# EAGLE design apple_night_light (EAGLE 7.2.0)
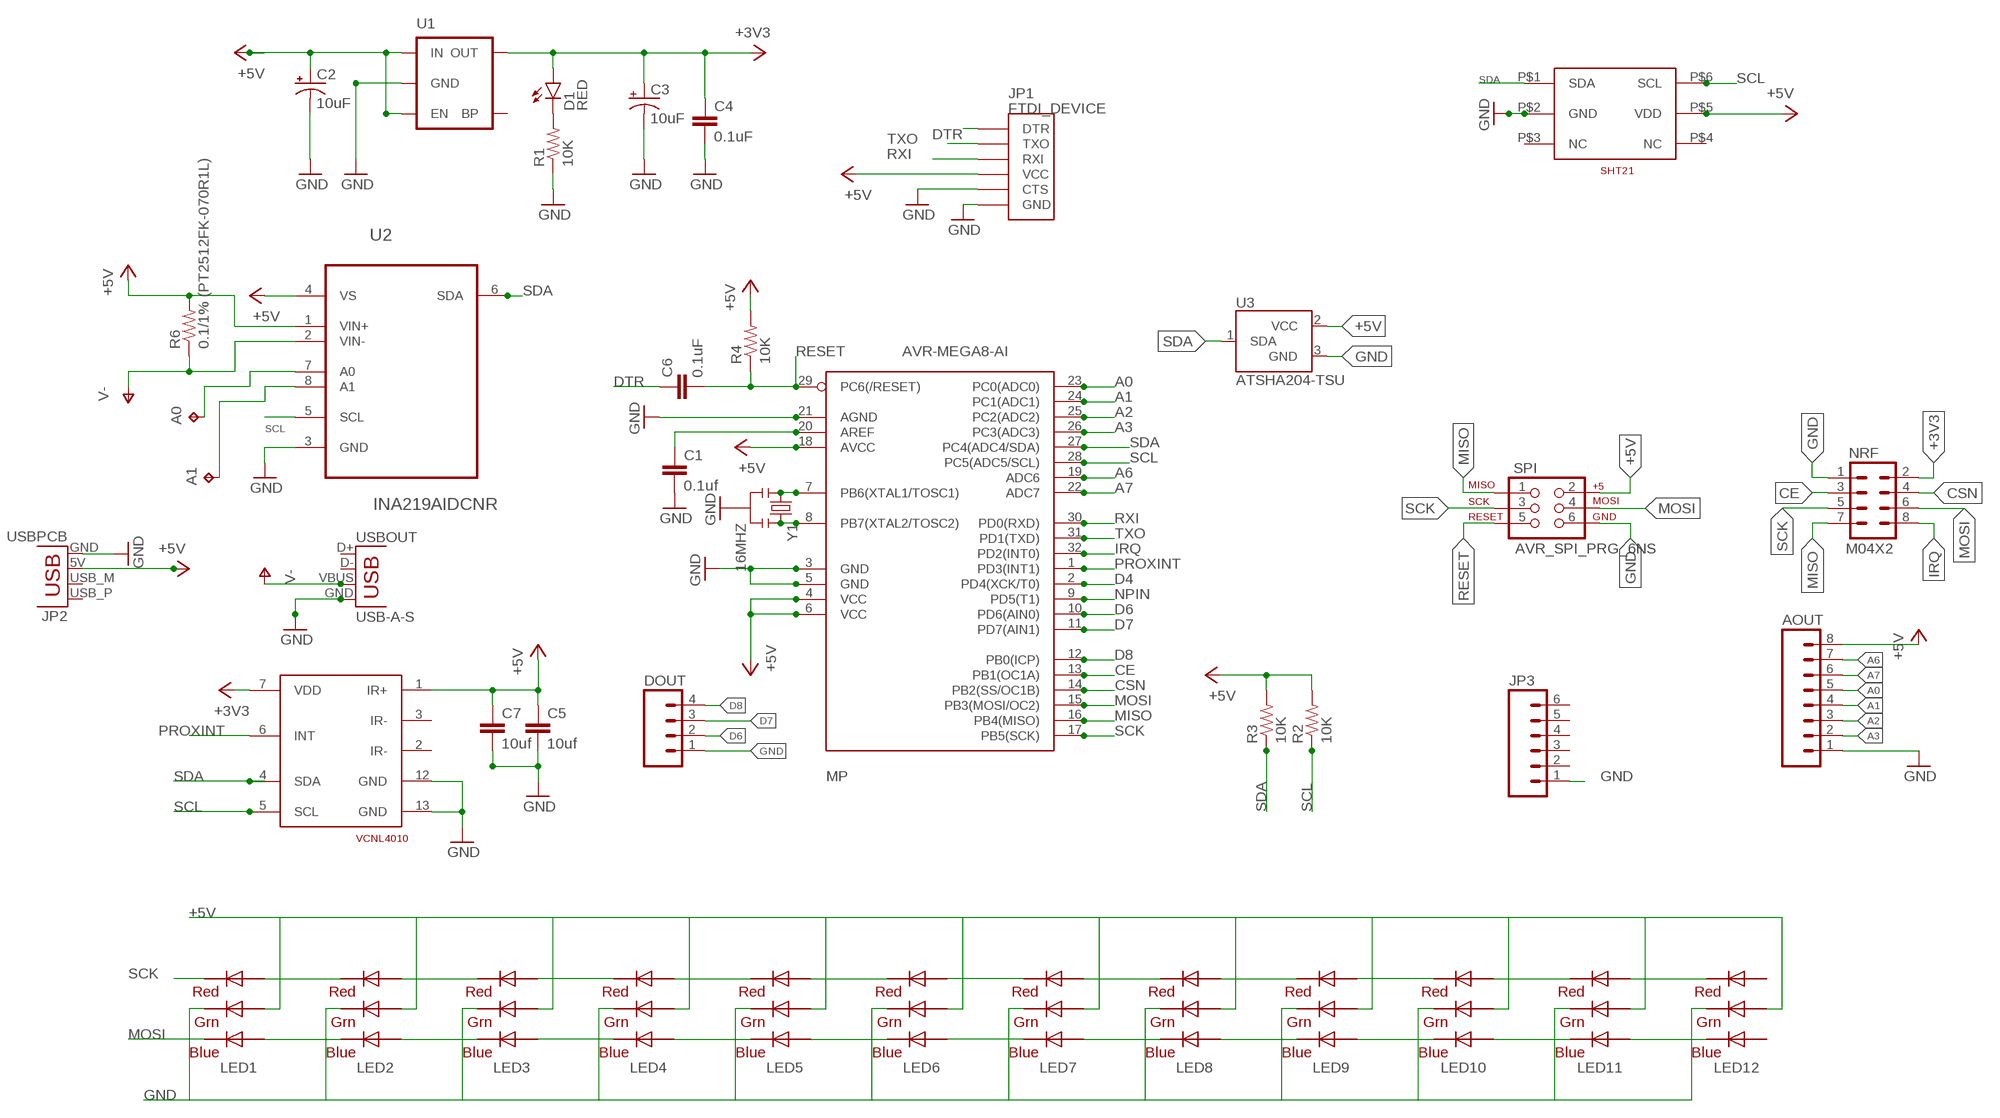
[diagram p0: schematic, sheet 1]

## Parts
A0  TPB1,27  [B1,27]
A1  TPB1,27  [B1,27]
AOUT  M08LOCK  [1X08_LOCK]
C1  0.1uf  2.2UF-25V-+80/-20(0805)  [0805]
C2  10uF  10UF-16V-10%(TANT)  [EIA3216]
C3  10uF  10UF-16V-10%(TANT)  [EIA3216]
C4  0.1uF  0.1UF-25V(+80/-20%)(0603)  [0603-CAP]
C5  10uf  CAP0805  [0805]
C6  0.1uF  0.1UF-25V(+80/-20%)(0603)  [0603-CAP]
C7  10uf  CAP0805  [0805]
D1  RED  LED-RED0603  [LED-0603]
DOUT  M04LOCK  [1X04_LOCK]
JP1  FTDI_DEVICE  [FTDI_DEVICE_SIDE]
JP2  USBPCB  [USB-A-PCB]
JP3  M06NO_SILK_FEMALE_PTH  [1X06_NO_SILK]
LED1  RGBLED5050  [RGBLED5050]
LED2  RGBLED5050  [RGBLED5050]
LED3  RGBLED5050  [RGBLED5050]
LED4  RGBLED5050  [RGBLED5050]
LED5  RGBLED5050  [RGBLED5050]
LED6  RGBLED5050  [RGBLED5050]
LED7  RGBLED5050  [RGBLED5050]
LED8  RGBLED5050  [RGBLED5050]
LED9  RGBLED5050  [RGBLED5050]
LED10  RGBLED5050  [RGBLED5050]
LED11  RGBLED5050  [RGBLED5050]
LED12  RGBLED5050  [RGBLED5050]
MP  AVR-MEGA8-AI  [TQFP32-08]
NRF  M04X2  [2X4]
R1  10K  10KOHM-1/10W-1%(0603)0603  [0603-RES]
R2  10K  10KOHM-1/10W-1%(0603)0603  [0603-RES]
R3  10K  10KOHM-1/10W-1%(0603)0603  [0603-RES]
R4  10K  10KOHM-1/10W-1%(0603)0603  [0603-RES]
R6  0.1/1% (PT2512FK-070R1L)  RESISTOR2512  [R2512]
SPI  AVR_SPI_PRG_6NS  [2X3-NS]
U1  MIC52053.3V  [SOT23-5]
U2  INA219AIDCNR  [SOT65P280X145-8N]
U3  ATSHA204-TSU  [SOT23-3]
U$1  SHT21  [DFN6]
U$3  VCNL4010  [VCNL4010]
USBOUT  USB-A-S  [USB-A-S]
Y1  16MHZ  RESONATOR16MHZ  [RESONATOR-SMD]

## Nets
+3V3: C3.A(+) C4.1 D1.A NRF.2 U1.5(OUT) U$3.7(VDD)
+5V: AOUT.8 C2.A(+) C5.1 C7.1 JP1.P$4(VCC) JP2.5V(VBUS) LED1.1(GREEN_A) LED2.1(GREEN_A) LED3.1(GREEN_A) LED4.1(GREEN_A) LED5.1(GREEN_A) LED6.1(GREEN_A) LED7.1(GREEN_A) LED8.1(GREEN_A) LED9.1(GREEN_A) LED10.1(GREEN_A) LED11.1(GREEN_A) LED12.1(GREEN_A) MP.4(VCC) MP.6(VCC) MP.18(AVCC) R2.2 R3.2 R4.2 R6.2 SPI.2 U1.1(IN) U1.3(EN) U2.1(VIN+) U2.4(VS) U3.2(VCC) U$1.P$5(VDD) U$3.1(IR+)
A0: AOUT.5 MP.23(PC0(ADC0))
A1: AOUT.4 MP.24(PC1(ADC1))
A2: AOUT.3 MP.25(PC2(ADC2))
A3: AOUT.2 MP.26(PC3(ADC3))
A6: AOUT.7 MP.19(ADC6)
A7: AOUT.6 MP.22(ADC7)
APACI1: LED3.2(RED_A) LED4.5(RED_C)
APACI2: LED6.2(RED_A) LED7.5(RED_C)
APACI3: LED9.2(RED_A) LED10.5(RED_C)
CE: MP.13(PB1(OC1A)) NRF.3
CSN: MP.14(PB2(SS/OC1B)) NRF.4
D4: MP.2(PD4(XCK/T0))
D6: DOUT.2 MP.10(PD6(AIN0))
D7: DOUT.3 MP.11(PD7(AIN1))
D8: DOUT.4 MP.12(PB0(ICP))
DTR: C6.1 JP1.P$1(DTR)
GND: AOUT.1 C1.2 C2.C(-) C3.C(-) C4.2 C5.2 C7.2 DOUT.1 JP1.P$5(CTS) JP1.P$6(GND) JP2.GND JP3.1 LED1.6(GREEN_C) LED2.6(GREEN_C) LED3.6(GREEN_C) LED4.6(GREEN_C) LED5.6(GREEN_C) LED6.6(GREEN_C) LED7.6(GREEN_C) LED8.6(GREEN_C) LED9.6(GREEN_C) LED10.6(GREEN_C) LED11.6(GREEN_C) LED12.6(GREEN_C) MP.3(GND) MP.5(GND) MP.21(AGND) NRF.1 R1.1 SPI.6 U1.2(GND) U2.3(GND) U3.3(GND) U$1.P$2(GND) U$3.12(GND) U$3.13(GND) USBOUT.GND Y1.2
IRQ: MP.32(PD2(INT0)) NRF.8
MISO: MP.16(PB4(MISO)) NRF.7 SPI.1
MOSI: LED1.4(BLUE_C) MP.15(PB3(MOSI/OC2)) NRF.6 SPI.4
N$1: LED1.2(RED_A) LED2.5(RED_C)
N$2: LED2.2(RED_A) LED3.5(RED_C)
N$3: LED1.3(BLUE_A) LED2.4(BLUE_C)
N$5: LED2.3(BLUE_A) LED3.4(BLUE_C)
N$6: LED3.3(BLUE_A) LED4.4(BLUE_C)
N$7: C1.1 MP.20(AREF)
N$8: LED6.3(BLUE_A) LED7.4(BLUE_C)
N$9: MP.8(PB7(XTAL2/TOSC2)) Y1.3
N$10: MP.7(PB6(XTAL1/TOSC1)) Y1.1
N$12: LED9.3(BLUE_A) LED10.4(BLUE_C)
N$15: LED4.2(RED_A) LED5.5(RED_C)
N$17: LED5.2(RED_A) LED6.5(RED_C)
N$18: LED4.3(BLUE_A) LED5.4(BLUE_C)
N$19: LED5.3(BLUE_A) LED6.4(BLUE_C)
N$23: LED7.2(RED_A) LED8.5(RED_C)
N$24: LED8.2(RED_A) LED9.5(RED_C)
N$25: LED7.3(BLUE_A) LED8.4(BLUE_C)
N$26: LED8.3(BLUE_A) LED9.4(BLUE_C)
N$29: D1.C R1.2
N$30: LED10.2(RED_A) LED11.5(RED_C)
N$31: LED11.2(RED_A) LED12.5(RED_C)
N$32: LED10.3(BLUE_A) LED11.4(BLUE_C)
N$35: LED11.3(BLUE_A) LED12.4(BLUE_C)
N$43: A0.TP U2.7(A0)
N$44: A1.TP U2.8(A1)
NPIN: MP.9(PD5(T1))
PROXINT: MP.1(PD3(INT1)) U$3.6(INT)
RESET: C6.2 MP.29(PC6(/RESET)) R4.1 SPI.5
RXI: JP1.P$3(RXI) MP.30(PD0(RXD))
SCK: LED1.5(RED_C) MP.17(PB5(SCK)) NRF.5 SPI.3
SCL: MP.28(PC5(ADC5/SCL)) R2.1 U2.5(SCL) U$1.P$6(SCL) U$3.5(SCL)
SDA: MP.27(PC4(ADC4/SDA)) R3.1 U2.6(SDA) U3.1(SDA) U$1.P$1(SDA) U$3.4(SDA)
TXO: JP1.P$2(TXO) MP.31(PD1(TXD))
V-: R6.1 U2.2(VIN-) USBOUT.VBUS
Unconnected: JP2.USB_M(D-) JP2.USB_P(D+) JP3.2 JP3.3 JP3.4 JP3.5 JP3.6 LED12.2(RED_A) LED12.3(BLUE_A) U1.4(BP) U$1.P$3(NC) U$1.P$4(NC) USBOUT.D+ USBOUT.D-

## Power pins joined to a net without a drawn wire
IR-: U$3.2(IR-) U$3.3(IR-)

## Library data of the parts
A0 A1 = testpad:TP: Test pad
AOUT = SparkFun-Connectors:M08: Header 8 Standard 8-pin 0.1" header. Use with straight break away headers (SKU : PRT-00116), right angle break away headers (PRT-00553), swiss pins (PRT-00743), machine pins (PRT-00117), and female headers (PRT-00115).
C1 = SparkFun-Capacitors:2.2UF-25V-+80/-20(0805): CAP-11624; PROD_ID: CAP-11624; VALUE: 2.2uF
C2 C3 = SparkFun-Capacitors:10UF-16V-10%(TANT): CAP-00811 1206/EIA-3216 Tantalum capacitor; PROD_ID: CAP-00811
C4 C6 = SparkFun-Capacitors:0.1UF-25V(+80/-20%)(0603): CAP-00810 Ceramic Standard decoupling cap; PROD_ID: CAP-00810
C5 C7 = SparkFun-Passives:CAP: Capacitor Standard 0603 ceramic capacitor, and 0.1" leaded capacitor.
D1 = SparkFun-LED:LED-RED: Assorted Red LEDs LilyPad 1206- DIO-09912 1206- DIO-00809 0603- DIO-00819; PROD_ID: DIO-00819
DOUT = SparkFun-Connectors:M04: Header 4 Standard 4-pin 0.1" header. Use with straight break away headers (SKU : PRT-00116), right angle break away headers (PRT-00553), swiss pins (PRT-00743), machine pins (PRT-00117), and female headers (PRT-00115). Molex polarized connector foot print use with SKU : PRT-08231 with associated crimp pins and housings. 1MM SMD Version SKU: PRT-10208
JP1 = SparkFun-Connectors:FTDI_DEVICE: Connector which mates to FTDI basic or FTDI cable.
JP2 USBOUT = SparkFun-Connectors:USB: USB Connectors USB-B-PTH is fully proven SKU : PRT-00139/CONN-08278 USB-miniB is fully proven SKU : PRT-00587 USB-A-PCB is untested. USB-A-H is throughly reviewed, but untested. Spark Fun Electronics SKU : PRT-00437 USB-B-SMT is throughly reviewed, but untested. Needs silkscreen touching up. USB-A-S has not been used/tested USB-MB-H has not been used/tested USB-MICROB has been used. CONN-09505
JP3 = SparkFun-Connectors:M06: Header 6 Standard 6-pin 0.1" header. Use with straight break away headers (SKU : PRT-00116), right angle break away headers (PRT-00553), swiss pins (PRT-00743), machine pins (PRT-00117), and female headers (PRT-00115). Molex polarized connector foot print use with SKU : PRT-08094 with associated crimp pins and housings. NOTES ON THE VARIANTS LOCK and LOCK_LONGPADS... This footprint was designed to help hold the alignment of a through-hole component (i.e. 6-pin header) while soldering it into place. You may notice that each hole has been shifted either up or down by 0.005 of an inch from it's more standard position (which is a perfectly straight line). This slight alteration caused the pins (the squares in the middle) to touch the edges of the holes. Because they are alternating, it causes a "brace" to hold the component in place. 0.005 has proven to be the perfect amount of "off-center" position when using our standard breakaway headers. Although looks a little odd when you look at the bare footprint, once you have a header in there, the alteration is very hard to notice. Also,if you push a header all the way into place, it is covered up entirely on the bottom side. This idea of altering the position of holes to aid alignment will be further integrated into the Sparkfun Library for other footprints. It can help hold any component with 3 or more connection pins.; PROD_ID: CONN-08437
LED1-LED12 = adafruit:RGBLED: For 5050 RGB LEDs, the order of the LEDs may vary from one manufacturer to another!
MP = SparkFun-DigitalIC:AVR-MEGA8: MICROCONTROLLER 8 Kbytes FLASH 1 kbytes SRAM 512 bytes EEPROM USART 6-channel 10 bit ADC 2-channel 8 bit ADC
NRF = SparkFun-Connectors:M04X2: .1" header, two rows of four.
R1-R4 = SparkFun-Resistors:10KOHM-1/10W-1%(0603): RES-00824; PROD_ID: RES-00824
R6 = SparkFun-Resistors:RESISTOR: Resistor Basic schematic elements and footprints for 0603, 1206, and PTH resistors.
SPI = SparkFun-Connectors:AVR_SPI_PRG_6: AVR ISP 6 Pin This is the reduced ISP connector for AVR programming. Common on Arduino. This footprint will take up less PCB space and can be used with a 10-pin to 6-pin adapter such as SKU: BOB-08508 **Special note about "TEST_POINT" package. The stop mask is on the top side, so if you want your programming test points to be on the bottom of your board, make sure to place this package on the bottom side of the board. This also ensure that the orientation to program from the bottom side will be correct.
U1 = SparkFun-PowerIC:MIC5205: MIC5205 150mA vreg 3.3V - VREG-00822 5V - VREG-00823; PROD_ID: VREG-00822
U2 = Texas Instruments_By_element14_Batch_1:INA219AIDCNR: CURRENT/POWER MONITOR; MPN: INA219AIDCNR; OC_FARNELL: 1682558; OC_NEWARK: 09P2546; PACKAGE: SOT-23-8; SUPPLIER: Texas Instruments
U3 = SparkFun-DigitalIC:ATSHA204: Atmel ATSHA204 The Atmel ATSHA204 is an optimized authentication chip that includes a 4.5Kb EEPROM. This array can be used for storage of keys, miscellaneous read/write, read-only, password or secret data, and consumption tracking. Access to the various sections of memory can be restricted in a variety of ways and then the configuration locked to prevent changes.
U$1 = samuel:SHT21
U$3 = samuel:VCNL4010
Y1 = SparkFun-FreqCtrl:RESONATOR: Resonator Small SMD resonator. Used, eg, on the Arduino Pro/ Pro Mini boards. 8MHz- XTAL-08895 16MHz- XTAL-08900; PROD_ID: XTAL-08900

## Board
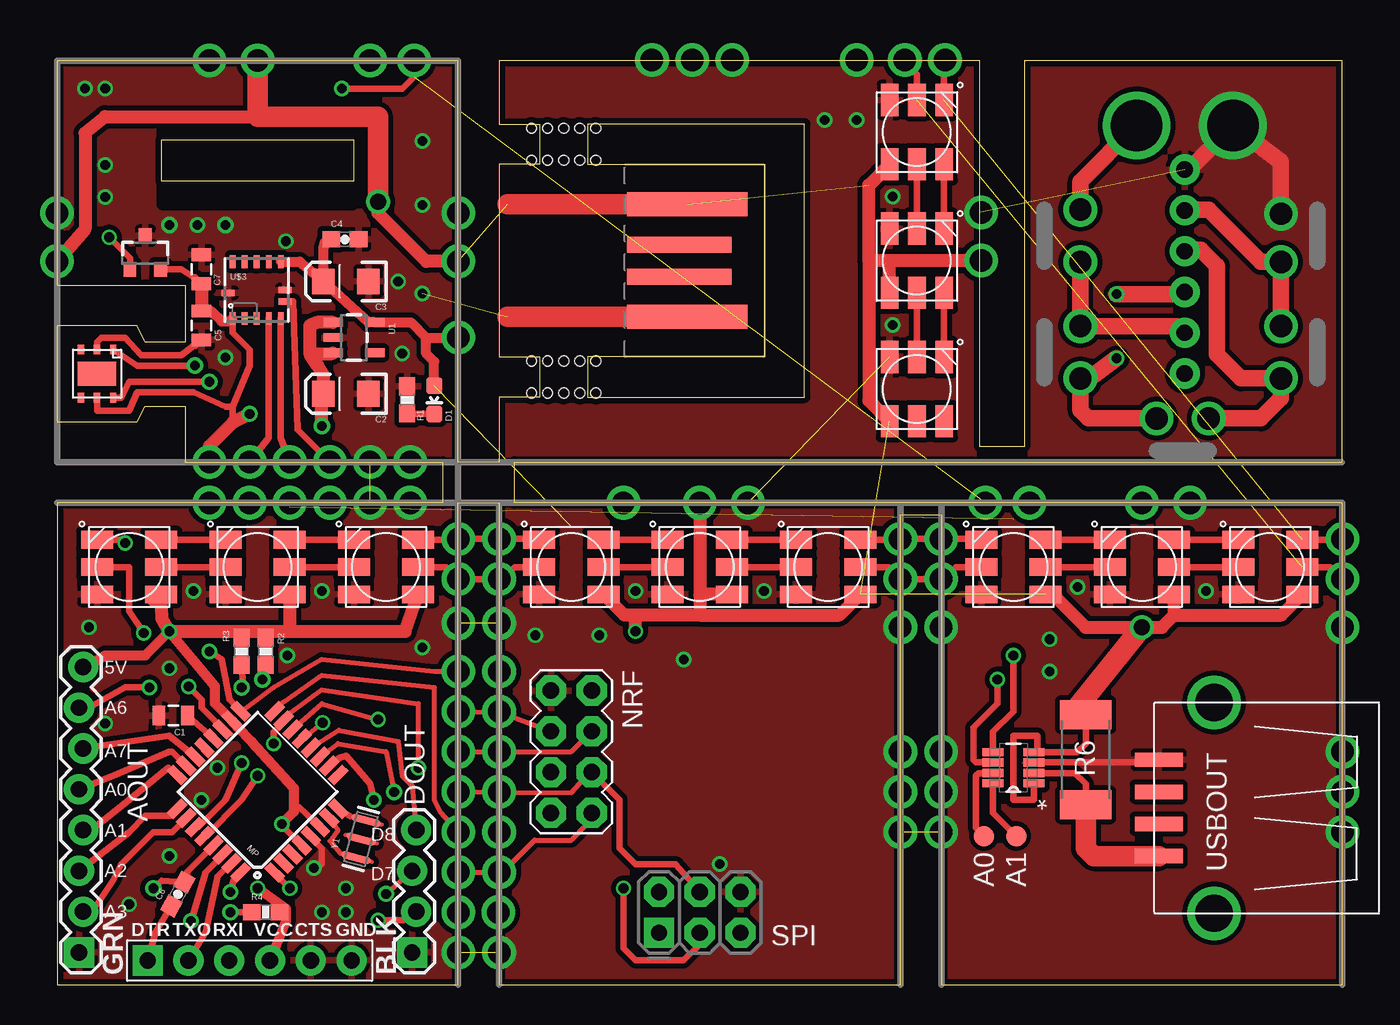
[diagram p1: board, top side]
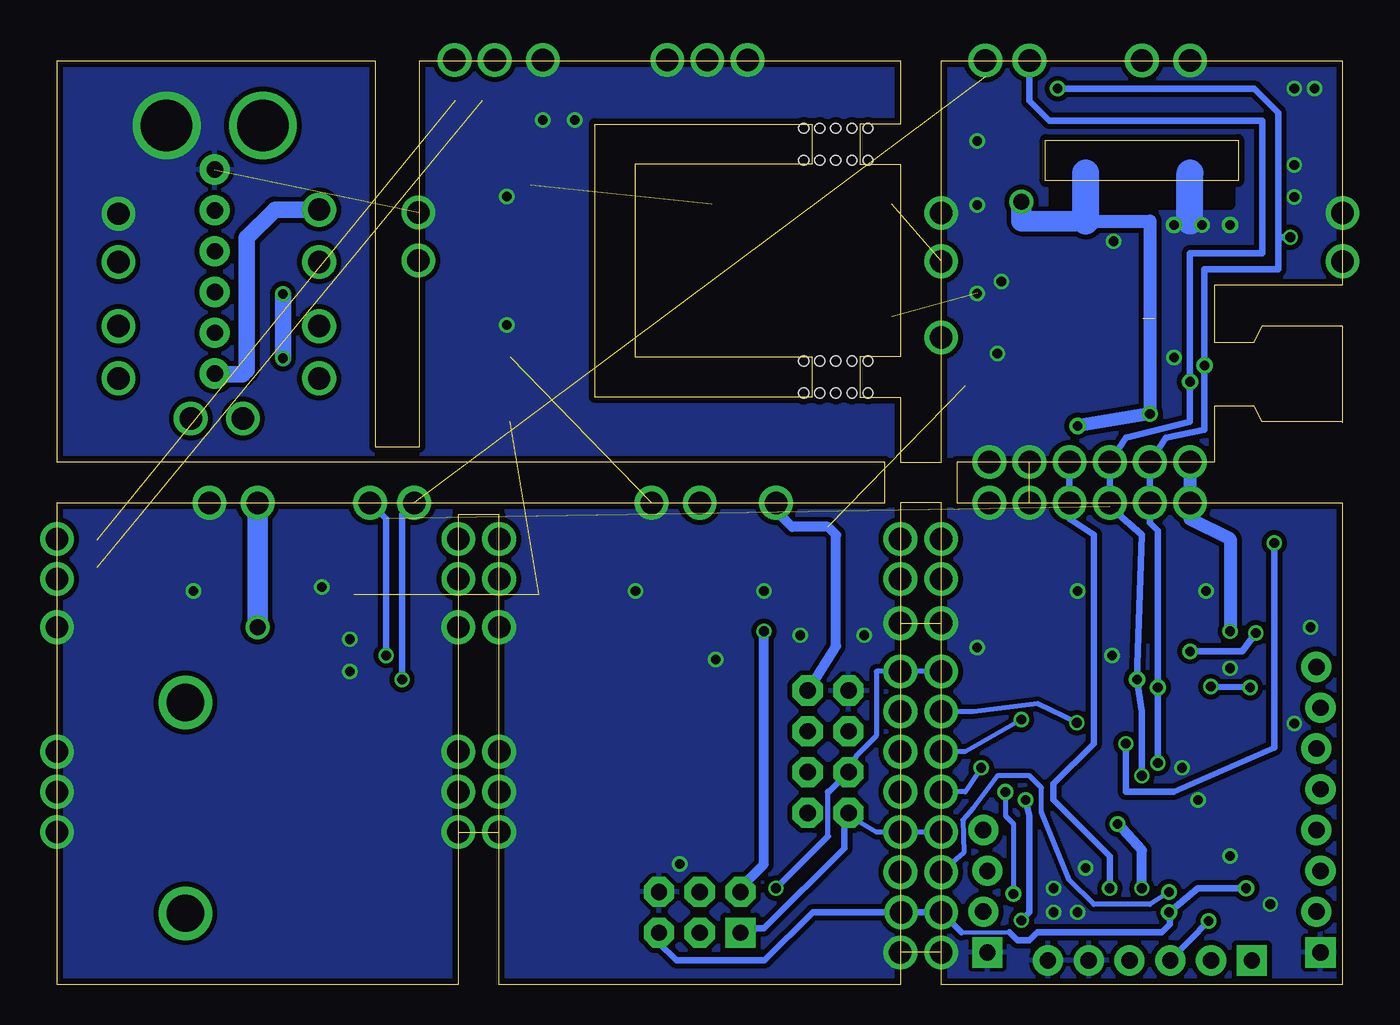
[diagram p2: board, bottom side, seen from below]

Size 80.08 x 57.54 mm. Coordinates in mm from the lower left corner, seen from the top.
Outline: 0,41.04 5,41.04 5.5,40 8,40 8,43.54 0,43.54 0,57.54 25,57.54 25,32.54 27.54,32.54 27.54,36.58 30.07,36.58 30.07,39.08 27.54,39.08 27.54,51.08 30.07,51.08 30.07,53.58 27.54,53.58 27.54,57.54 57.5,57.54 57.5,33.5 60.25,33.5 60.25,57.54 80.08,57.54 80.08,32.54 28.5,32.54 28.5,30 80.08,30 80.08,0 55.08,0 55.08,29.25 52.54,29.25 52.54,0 27.54,0 27.54,30 25,30 25,0 0,0 0,30 24.03,30 24.03,32.54 8,32.54 8,36 5.5,36 5,35.04 0,35.04
Outline: 0,41 0,35
Outline: 6.5,50.04 18.5,50.04 18.5,52.59 6.5,52.59 6.5,50.04
Outline: 33.06,36.58 46.56,36.58 46.56,53.58 33.06,53.58 33.06,51.08 44.06,51.08 44.06,39.08 33.06,39.08 33.06,36.58
Copper layers (1*16): Top 0.0356mm / dielectric 1.5011mm / Bottom 0.0356mm
Design rules "LaenPCBOrder": minimum track width 6mil, minimum drill 13mil, track to track 6mil, track to pad 6mil, pad to pad 6mil, via to via 6mil, smd to smd 6mil, copper to edge 15mil, drill to drill 6mil, minimum pad ring 7mil, minimum via ring 7mil, stop-mask expansion 3mil, vias tented up to drill 0mil, thermal gap 10mil
Holes 0.6 mm at 32.56,53.33 31.57,53.33 30.57,53.33 30.57,51.33 31.57,51.33 32.56,51.33 32.56,38.83 31.57,38.83 30.57,38.83 30.57,36.83 31.57,36.83 32.56,36.83 33.56,53.33 33.56,51.33 29.57,51.33 29.57,53.33 33.56,38.83 33.56,36.83 29.57,36.83 29.57,38.83
tRestrict: area 27.6,36.6 to 46.6,53.6; area 6.5,48.5 to 18.5,53; area 0,32.5 to 8,43.5; area 0,30 to 80.2,32.5; area 25,0 to 27.5,57.5; area 52.5,0 to 55,29.2; area 57.5,33.5 to 60.2,57.5
bRestrict: area 7,48.5 to 18,52.5; area 27.6,36.6 to 46.6,53.6; area 0,32.5 to 8,43.5; area 0,30 to 80.2,32.5; area 57.5,33.5 to 60.2,57.5; area 25,0 to 27.5,57.5; area 52.5,0 to 55,29.2

### Footprints (pad centres in the part's own frame; a part is rotated, then mirrored left to right if it is on the bottom)
B1,27 = smd 1.27 x 1.27: TP 0,0
1X08_LOCK = drill 1.016 pad 1.88 square: 1 0,0.127 | drill 1.016 pad 1.88: 2 2.54,-0.127; 3 5.08,0.127; 4 7.62,-0.127; 5 10.16,0.127; 6 12.7,-0.127; 7 15.24,0.127; 8 17.78,-0.127
0805 = smd 0.8 x 1.2: 1 -0.9,0; 2 0.9,0
EIA3216 = smd 1.4 x 1.6: A 1.4,0; C -1.4,0
0603-CAP = smd 1.1 x 1: 1 -0.85,0; 2 0.85,0
LED-0603 = smd 1 x 1: A 0,-0.877; C 0,0.877
1X04_LOCK = drill 1.016 pad 1.88 square: 1 0,0.127 | drill 1.016 pad 1.88: 2 2.54,-0.127; 3 5.08,0.127; 4 7.62,-0.127
FTDI_DEVICE_SIDE = drill 1.016 pad 1.88 square: P$1 -6.35,0 | drill 1.016 pad 1.88: P$2 -3.81,0; P$3 -1.27,0; P$4 1.27,0; P$5 3.81,0; P$6 6.35,0
USB-A-PCB = smd 7.5 x 1.5: 5V -0.2,-3.5; GND -0.2,3.5 | smd 6.5 x 1: USB_M 0.3,-1; USB_P 0.3,1
1X06_NO_SILK = drill 1.016 pad 1.88: 1 0,0; 2 2.54,0; 3 5.08,0; 4 7.62,0; 5 10.16,0; 6 12.7,0
RGBLED5050 = smd 2 x 1.1: 1 -2,1.7; 2 -2,0; 3 -2,-1.7; 4 2,-1.7; 5 2,0; 6 2,1.7
TQFP32-08 = smd 1.27 x 0.559: 1 -4.293,2.8; 2 -4.293,2; 3 -4.293,1.2; 4 -4.293,0.4; 5 -4.293,-0.4; 6 -4.293,-1.2; 7 -4.293,-2; 8 -4.293,-2.8; 17 4.293,-2.8; 18 4.293,-2; 19 4.293,-1.2; 20 4.293,-0.4; 21 4.293,0.4; 22 4.293,1.2; 23 4.293,2; 24 4.293,2.8 | smd 0.559 x 1.27: 9 -2.8,-4.293; 10 -2,-4.293; 11 -1.2,-4.293; 12 -0.4,-4.293; 13 0.4,-4.293; 14 1.2,-4.293; 15 2,-4.293; 16 2.8,-4.293; 25 2.8,4.293; 26 2,4.293; 27 1.2,4.293; 28 0.4,4.293; 29 -0.4,4.293; 30 -1.2,4.293; 31 -2,4.293; 32 -2.8,4.293
2X4 = drill 1.016 pad 1.88 octagon: 1 -3.81,-1.27; 2 -3.81,1.27; 3 -1.27,-1.27; 4 -1.27,1.27; 5 1.27,-1.27; 6 1.27,1.27; 7 3.81,-1.27; 8 3.81,1.27
0603-RES = smd 1.1 x 1: 1 -0.85,0; 2 0.85,0
R2512 = smd 1.8 x 3.2: 1 -2.8,0; 2 2.8,0
2X3-NS = drill 1.016 pad 1.88 square: 1 -2.54,-1.27 | drill 1.016 pad 1.88 octagon: 2 -2.54,1.27; 3 0,-1.27; 4 0,1.27; 5 2.54,-1.27; 6 2.54,1.27
SOT23-5 = smd 0.55 x 1.2: 1 -0.95,-1.3; 2 0,-1.3; 3 0.95,-1.3; 4 0.95,1.3; 5 -0.95,1.3
SOT65P280X145-8N = smd 1.321 x 0.508: 1 -1.27,0.965; 2 -1.27,0.33; 3 -1.27,-0.33; 4 -1.27,-0.965; 5 1.27,-0.965; 6 1.27,-0.33; 7 1.27,0.33; 8 1.27,0.965
SOT23-3 = smd 0.8 x 0.9: 1 -0.95,-1; 2 0.95,-1; 3 0,1.1
DFN6 = smd 0.4 x 0.6: P$1 -1,-1.5; P$2 0,-1.5; P$3 1,-1.5; P$4 1,1.5; P$5 0,1.5; P$6 -1,1.5 | smd 2.4 x 1.5: P$7 0,0
VCNL4010 = smd 0.35 x 0.805: 1 -1.5,-1.772; 2 -0.75,-1.772; 3 0,-1.772; 4 0.75,-1.772; 5 1.5,-1.772; 7 1.5,1.772; 8 0.75,1.772; 9 0,1.772; 10 -0.75,1.772; 11 -1.5,1.772 | smd 0.805 x 0.4: 6 1.772,-0.715; 12 -1.772,-0.175 | smd 0.8 x 0.4: 13 1.77,0
USB-A-S = smd 3 x 0.9: D+ 3.45,-1; D- 3.45,1; GND 3.45,-3; VBUS 3.45,3 | drill 2.311: P$5 0,-6.566; P$6 0,6.566
RESONATOR-SMD = smd 0.45 x 1.905: 1 -1.2,0; 2 0,0; 3 1.2,0

### Placement (x,y rotation side)
A0  57.75,9.25 0 top
A1  59.75,9.25 0 top
AOUT  1.5,2 90 top
C1  7.25,16.75 180 top
C2  18,36.79 180 top
C3  18,43.79 180 top
C4  17.94,46.41 0 top
C5  9,41.04 270 top
C6  7.53,5.63 61.1 top
C7  9,44.54 90 top
D1  23.5,36.41 180 top
DOUT  22.25,2 90 top
JP1  12,1.5 0 top
JP2  39.06,45.08 180 top
JP3  70.25,50.75 270 top
LED1  4.5,26 180 top
LED2  12.5,26 180 top
LED3  20.5,26 180 top
LED4  32.04,26 180 top
LED5  40.04,26 180 top
LED6  48.04,26 180 top
LED7  59.58,26 180 top
LED8  67.58,26 180 top
LED9  75.58,26 180 top
LED10  53.56,53.08 90 top
LED11  53.56,45.08 90 top
LED12  53.56,37.08 90 top
MP  12.5,12 135 top
NRF  32.04,14.5 270 top
R1  21.82,36.41 270 top
R2  13,20.75 90 top
R3  11.5,20.75 90 top
R4  13,4.5 0 top
R6  64.08,14 90 top
SPI  40.04,4.5 0 top
U1  18.5,40.29 270 top
U2  59.58,13.5 180 top
U3  5.5,45.54 0 top
U$1  2.5,38.04 180 top
U$3  12.44,43.25 0 top
USBOUT  72.08,11 180 top
Y1  18.94,9.06 75 top

### Tracks (layer width: path | path; a pad name or v marks a point on that pad's centre or on a via)
+3V3  (via drill 1.4)  (1 unrouted)
  Top 0.61: 23,40.29 22.05,41.24 U1.5 19.4,41.24 C3.A | 23,40.29 v25,40.29 | D1.A 23.5,38.79 23,39.29 23,40.29 | U$3.7 15.12,45.02 C3.A | C3.A 16.6,45.89 16.75,46.29 16.97,46.29 C4.1
  Bottom 0.61: NRF.2 31.54,21.08 31.54,28 32.04,28.5 34.29,28.5 35.04,29.25 35.04,29.75 v35.29,30
+5V  (via drill 0.6, 0.6 pad 1.02, 1, 1.4, 1.4 pad 1.02, 1.4 pad 1.42)  (4 unrouted)
  Top 0.406: R4.2 14.27,4 | v14,10 14,9.93 MP.4 | 14.75,10.75 15.1,11.05 MP.6 | U$1.P$5 2.5,35.74 4.5,35.74 5,36.89 8.5,36.89 10.5,35.98 10.94,35.98 | 11,35.04 10.94,35.04 | 10.94,35.04 10.94,35.98 | 10.94,35.98 12,38.54 12,39.54 10.94,40.6 U$3.1 | 10.94,35.04 10.94,34.98 | R6.2 64.08,15 63.55,14.46 U2.4 61.08,14.46 61.08,15.5 59.58,15.5 59.58,11.5 60.85,11.5 U2.1 | U3.2 7.75,44.54 8.5,44.04 8.6,44.04 C7.1 | R2.2 12.75,22
  Top 0.61: JP1.P$4 14.27,4 14.27,4.73 v12.5,6 | v14,10 14.75,10.75 14.75,12.25 12.13,15.12 11.3,16 MP.18 9.84,17.49 9.84,18.59 v7,22 5.5,20.5 3,20.5 2.38,20.13 2.35,20.13 AOUT.8 | C5.1 9.6,41.94 10.25,41.29 10.75,41.29 U$3.1 | R3.2 11.5,22 | 6,23.8 LED1.1
  Top 0.813: 10.94,34.98 9.5,33.54 v9.5,32.54 | 11,35.04 v12,35.54 | C7.1 C5.1 | v16.5,34.79 16.5,36.69 C2.A 16.6,37.94 16.25,38.54 15.75,39.29 | 15.75,39.29 17.15,39.29 U1.3 | U1.1 16.2,41.24 15.75,41.04 15.75,39.29 | v57.56,45.08 51.81,45.08 | 51.81,45.08 50.56,45.08 | 50.56,45.08 50.56,36.38 LED12.1 | LED11.1 51.87,45.03 51.81,45.08 | 50.56,45.08 50.56,49.78 LED10.1 | 69.58,23 68.83,22.25 v67.58,22.25 64.08,22.25 62.03,24.3 LED7.1 | 69.58,23 76.28,23 LED9.1 | LED8.1 69.58,23 | 12.5,54.04 3,54.04 1.75,53.04 1.75,47.04 v0,45.04 | v25,45.04 23,45.04 20,48.04 v20,48.75 | v40.04,30 40.04,24.25 | 40.04,24.25 40.04,23 | 40.04,23 48.74,23 LED6.1 | LED5.1 40.09,24.3 40.04,24.25 | 40.04,23 36.04,23 | 36.04,23 35.34,23 LED4.1 | v36.04,22 36.04,23 | 14.5,22 12.75,22 11.5,22 v7,22 6.55,22.75 LED1.1 | 14.5,22 21.7,22 LED3.1 | LED2.1 14.5,22
  Top 1.27: v67.58,22.25 63.58,17.3 R6.2 | JP2.5V 28.07,48.58 | v12.5,57.54 12.5,54.04 20,54.04 v20,48.75
  Bottom 0.61: v12.5,6 12.5,8.35 v14,10 | SPI.2 37.5,6.04 36.04,7.5 v36.04,22
  Bottom 0.813: v9.5,32.54 9.5,29 7,27.75 v7,22 | v16.5,34.79 v12,35.54 12,47.54 16,47.54
  Bottom 1.27: v67.58,22.25 v67.58,30 | v20,48.75 20,47.54 16,47.54
  Bottom 1.676: 16,47.54 16,50.54
+5V1  (via drill 1.4 pad 1.02)
  other vias: 9.5,30
A0
  Top 0.406: MP.23 7.17,14.5 7,14.5 3.5,13 AOUT.5
A1
  Top 0.406: MP.24 6.93,13.5 4.5,11.5 2.12,9.62 AOUT.4
A2
  Top 0.406: MP.25 7.04,10.5 5.5,10.5 4.5,9.5 AOUT.3
A3
  Top 0.406: MP.26 7.17,9.5 6,9.5 4,7.5 3.5,6.5 2.5,5 AOUT.2
A6  (via drill 0.6)
  Top 0.406: AOUT.7 1.99,17.24 4.25,18.5 v5.75,18.5 | MP.19 10.31,15.94 9,17.25 9,17.75 v8.2,18.55
  Bottom 0.406: v8.2,18.55 v5.75,18.5
A7
  Top 0.406: MP.22 7,15.5 AOUT.6
APACI1
  Top 0.406: LED3.2 24.25,26 25,25.25 27.75,25.25 28.5,26 LED4.5
APACI2
  Top 0.406: LED6.2 51.79,26 52.54,25.25 55.25,25.25 56,26 LED7.5
APACI3  (1 unrouted)
  Top 0.406: LED9.2 79.33,26 80.08,25.25 | LED10.5 53.56,56.69 52.75,57.5
CE  (via drill 0.6, 1.4)
  Top 0.305: MP.13 15.32,15.32 v16.55,16.3 | v25,17 27.57,16.97 NRF.3
  Bottom 0.305: v16.55,16.3 19,17.5 23,17 v25,17
CE1  (via drill 1.4)
  other vias: 27.54,17
CSN  (via drill 0.6, 1.4)
  Top 0.305: MP.14 16.5,17.5 v20,16.5 | v25,14.5 32.04,14.5 NRF.4
  Bottom 0.305: v20,16.5 23.5,14.5 v25,14.5
CSN1  (via drill 1.4)
  other vias: 27.54,14.5
D6  (via drill 0.6)
  Top 0.406: MP.10 17.62,14.12 18,14.25 19.5,12.5 v19.75,11.5 | v20,4 21.59,4 DOUT.2
  Bottom 0.406: v19.75,11.5 19.5,10.5 19.5,4.5 v20,4
D7  (via drill 0.6 pad 1.02)
  Top 0.305: MP.11 17.5,15 20.5,14.5 v21,12 | v20.5,5.65 DOUT.3
  Bottom 0.305: v21,12 21,10.5 20.5,10 v20.5,5.65
D8
  Top 0.305: MP.12 17.55,15.85 21.25,15.15 21.5,13 22.13,12.37 DOUT.4
DTR
  Top 0.406: JP1.P$1 6.15,3.3 C6.1
GND  (via drill 0.6, 0.6 pad 1.02, 1.4, 1.4 pad 1.02, 1.4 pad 1.42, 3.2)  (7 unrouted)
  Top 0.406: U2.3 68.63,13.83 USBOUT.GND | MP.5 15.82,9.18 16.5,8.5 16.5,7.5 16,7 | U$1.P$2 2.5,40.04 2.75,40.29 4.25,40.29 5.25,39.2 7.75,39.2 8.5,39.79 8.65,39.79 C5.2
  Top 1.016: JP3.1 70.5,50.75 v73.25,53.5 76.25,51.25 v76.25,48
  Top 1.27: JP2.GND 28.07,41.58
  Bottom 1.676: 9.5,47.54 9.5,50.54
  other vias: 18,4.5 4.5,5 7,8 18,6 16.5,4.5 52.54,9.5 80.08,9.5 52.54,12 52.54,14.5 80.08,12 80.08,14.5 25,2 19.5,32.54 22,32.54 7,47.29 10.5,47.29 9.5,57.54 41.29,7.5 8.75,47.29 10.5,39.04 52.06,49.08 71.58,24.5 63.58,24.75 70.58,30 22.75,52.54 22.75,48.54 22.75,43.04 52.06,41.08 21.25,43.79 14.25,46.29 44.04,24.5 36.04,24.5 33.79,21.75 29.79,21.75 39.04,20.25 1.75,55.79 3,51.04 3,55.79 3,49.04 21.5,39.29 16.5,24.5 8.5,24.5 9,11.5 10,13.5 2,22.25 3,16.25 25,22.5 22.75,21 52.54,22.25 80.08,22.25 61.83,19.5 61.83,21.5 43.04,30 25,48.04 0,48.04 57.56,48.08 47.81,53.83 49.81,53.83 19.5,30 22,30 27.54,2 27.54,22.5 37.06,57.58 39.56,57.58 42.06,57.58 49.81,57.58 55.08,9.5 55.08,12 55.08,14.5 55.08,22.25 16,7.25 14.35,20.5 7,19.7
  pour Bottom (isolate 0.305): 0,0.5 0.5,0 79.54,0 79.54,57.58 25,57.54 0,57.54
  pour Top (isolate 0.305): 0,0 0,57.54 25,57.54 79.54,57.58 79.54,0
IR-  (1 unrouted)
IRQ  (via drill 0.6, 1.4)
  Top 0.305: v25,7 27.75,7 29.75,9 32.04,9 33.04,10 33.04,10.42 NRF.8
  Top 0.406: MP.32 11,6.5 v10.8,5.77
  Bottom 0.305: v10.8,5.77 12,5 15.5,5 17,6.5 18.75,10.75 18.75,12.25 19.5,13 21.5,13 23,11 23.65,10.25 23.6,8.2 v25,7
IRQ1  (via drill 1.4)
  other vias: 27.54,7
MISO  (via drill 1.4)
  Top 0.305: MP.16 14.05,17.55 16.5,19.25 23.5,18.5 23.5,11.5 23.9,10.7 v25,9.5
  Bottom 0.305: v25,9.5 29.04,9.5 30.27,10.23 NRF.7
  Bottom 0.406: SPI.1 36.81,3.23 36.54,3.5 36.04,3.5 31.04,8.5 31.04,10.42 NRF.7
MISO1  (via drill 1.4)
  other vias: 27.54,9.5
MOSI  (via drill 0.6, 1.4)
  Top 0.305: MP.15 14.12,16.62 16.5,18.35 22.5,17.5 v22.5,13.5 | v25,12 32.04,11.95 32.81,12.77 NRF.6
  Top 0.406: SPI.4 38.54,7.5 36.04,7.5 35.04,8.5 35.04,11.5 NRF.6 | 2.55,27.75 LED1.4 4.05,27.7 v4.25,27.5 | 14.12,16.62 14.12,16.37 13.5,15.75 v13.5,15
  Bottom 0.305: v22.5,13.5 23.5,12 v25,12
  Bottom 0.406: v4.25,27.5 4.25,14.75 10.5,12 13.5,12 v13.5,15
MOSI1  (via drill 1.4)
  other vias: 27.54,12
N$1
  Top 0.406: LED1.2 LED2.5
N$2
  Top 0.406: LED2.2 LED3.5
N$3
  Top 0.406: LED1.3 LED2.4
N$5
  Top 0.406: LED2.3 LED3.4
N$6
  Top 0.406: LED3.3 24.95,27.7 25,27.75 29.99,27.75 LED4.4
N$7
  Top 0.406: MP.20 C1.1
N$8
  Top 0.406: LED6.3 52.49,27.7 52.54,27.75 57.53,27.75 LED7.4
N$9
  Top 0.406: MP.8 18.27,10.48
N$10
  Top 0.305: MP.7 17.5,9.6 17,8.93 17.65,8.16
N$11  (via drill 1.4)
  other vias: 25,25.25
N$12  (1 unrouted)
  Top 0.406: LED9.3 80.03,27.7 80.08,27.75 | 55.31,55.13 LED10.4 55.27,57.48 55.25,57.5
N$13  (via drill 1.4)
  other vias: 25,27.75
N$14  (via drill 1.4)
  other vias: 52.54,27.75
N$15
  Top 0.406: LED4.2 LED5.5
N$17
  Top 0.406: LED5.2 LED6.5
N$18
  Top 0.406: LED4.3 LED5.4
N$19
  Top 0.406: LED5.3 LED6.4
N$20  (via drill 1.4)
  other vias: 52.54,25.25
N$21  (via drill 1.4)
  other vias: 27.54,25.25
N$23
  Top 0.406: LED7.2 LED8.5
N$24
  Top 0.406: LED8.2 LED9.5
N$25
  Top 0.406: LED7.3 LED8.4
N$26
  Top 0.406: LED8.3 LED9.4
N$27  (via drill 1.4)
  other vias: 80.08,27.75
N$28  (via drill 1.4)
  other vias: 80.08,25.25
N$29
  Top 0.406: R1.2 23.47,35.56 D1.C
N$30
  Top 0.406: LED10.2 LED11.5
N$31
  Top 0.406: LED11.2 LED12.5
N$32
  Top 0.406: LED10.3 LED11.4
N$35
  Top 0.406: LED11.3 LED12.4
N$36  (via drill 1.4)
  other vias: 27.54,27.75
N$37
  Top 0.406: 55.27,57.63 55.31,57.58
N$38  (via drill 1.4)
  other vias: 55.31,57.58
N$39  (via drill 1.4)
  other vias: 52.81,57.58
N$40
  Top 0.406: 55.03,27.7 55.08,27.75
N$41  (via drill 1.4)
  other vias: 55.08,27.75
N$42  (via drill 1.4)
  other vias: 55.08,25.25
N$43
  Top 0.406: U2.7 57.42,13.17 57.25,13 57.25,9.75 A0.TP
N$44
  Top 0.406: U2.8 58.31,10.69 A1.TP
N$45
  Top 1.016: 63.5,41 69.75,41 70.25,40.5
N$47  (via drill 1.4)
  Top 1.016: v76.25,45 75,45 71.75,48.25 70.25,48.25
N$48  (via drill 1.4)
  Top 1.016: 76,45 76.25,45 v76.25,41
N$49  (via drill 1.4)
  Top 1.016: v71.75,35.25 75,35.25 76.25,36.5 v76.25,37.75 73.75,37.75 72.25,39.25 72.25,44.75 71.25,45.75 70.25,45.75
N$51  (via drill 0.6, 1.4)
  Top 1.016: v68.5,35.25 64.25,35.25 63.75,35.75 63.75,37.5 64,37.5 v66,39 | v66,43 70,43 70.25,43.25
  Bottom 1.016: v66,39 v66,43
N$52  (via drill 1.4)
  other vias: 63.75,37.75
N$53  (via drill 1.4)
  Top 1.016: v63.75,41 v63.75,45
N$55  (via drill 1.4, 3.2)
  Top 1.016: v67.25,53.5 63.75,50 v63.75,48.25
  Bottom 1.016: 70.25,38 68.5,38 68.25,38.25 68.25,46.5 66.5,48.25 v63.75,48.25
PROXINT  (via drill 0.6, 1.4 pad 1.02)
  Top 0.406: MP.1 13.55,6.95 v14.5,6 | v17,32.54 15,34.54 14.71,42.54 U$3.6
  Bottom 0.406: v14.5,6 14.5,8 18,11.5 18,12.5 15.5,15 15.5,28 17,29 v17,32.54
PROXINT1  (via drill 1.4 pad 1.02)
  other vias: 17,30
RESET  (via drill 0.6 pad 1.02, 1.4)
  Top 0.406: MP.29 8.13,7.06 C6.2 6.52,6.48 v6,6 | v10.8,4.5 R4.1
  Bottom 0.254: 23.75,3.25 20.75,3.25
  Bottom 0.406: v6,6 9,6 v10.8,4.5 10.75,4.45 10.75,3.75 11.25,3.25 19,3.25 19.5,2.75 20.25,2.75 20.75,3.25 | SPI.5 42.58,2.58 41.5,1.5 36,1.5 33,4.5 v27.5,4.5 v25,4.5 23.75,3.25
RXI  (via drill 0.6)
  Top 0.406: MP.30 10.31,8.06 9.25,7 v8.35,3.95
  Bottom 0.406: v8.35,3.95 JP1.P$3
SCK  (via drill 0.6, 1.4)
  Top 0.305: MP.17 11.52,17.02 13.5,18.5 16.5,20.25 23.5,19.5 v25,19.5
  Top 0.406: v35.29,6 35.29,2.25 36.04,1.5 39.04,1.5 40.04,2.5 SPI.3 | MP.17 10.75,17.75 10.25,20.25 v9.5,20.75 | v5.4,21.9 4.5,23.25 4.5,26 LED1.5
  Bottom 0.305: v25,19.5 29.04,19.5 29.04,15.5 30.31,14.23 NRF.5 | 32.04,9.25 32.04,12
  Bottom 0.406: v35.29,6 32.04,9.25 | 32.04,12 32,12 NRF.5 | v9.5,20.75 6.25,20.75 v5.4,21.9
SCK1  (via drill 1.4)
  other vias: 27.54,19.5
SCL  (via drill 0.6, 0.6 pad 1.02, 1.4, 1.4 pad 1.02)  (1 unrouted)
  Top 0.406: MP.28 9.25,9.25 11.5,11.5 v12.5,13 | v14.5,32.54 13.94,34.04 U$3.5 | v12.8,19 R2.1 | U$1.P$6 4,36.54 4.5,37.54 v9.5,37.54 | U2.5 58.31,15.73 59.58,17 v59.58,20.5
  Bottom 0.406: v12.5,13 12.5,17 v12.8,19 12.5,28 14.5,29.75 v14.5,32.54 13.5,34.04 9.5,35.04 v9.5,37.54 9.5,45.54 5,45.54 5,53.79 18.25,53.79 19.5,55.04 v19.5,57.54 | v59.58,20.5 59.58,29 v60.58,30
SCL1  (via drill 1.4 pad 1.02)
  other vias: 14.5,30
SDA  (via drill 0.6, 0.6 pad 1.02, 1.4, 1.4 pad 1.02)  (1 unrouted)
  Top 0.406: MP.27 8.81,9.81 10.5,11.5 v11.5,13.8 | v12,32.54 13.2,34.04 13.2,35.29 U$3.4 | R3.1 11.56,19 v11.5,18.5 | U$1.P$1 5,38.54 v8.6,38.54 | U2.6 57.25,13.83 57.08,14 57.08,16 58.58,17.5 v58.58,19 | v22.25,57.54 22.25,56.54 21.5,55.79 v17.75,55.79 | U3.1 4.55,45.24 v3.25,46.54
  Bottom 0.406: v11.5,13.8 v11.5,18.5 11.5,28.25 12,28.75 v12,32.54 11,34.04 8.6,34.54 v8.6,38.54 8.6,44.54 4,44.54 4,46.54 | v58.58,19 58.58,29.25 v57.83,30 | 4,46.54 4,54.29 5.5,55.79 v17.75,55.79 | v3.25,46.54 4,46.54
SDA1  (via drill 1.4 pad 1.02)
  other vias: 12,30
TXO
  Top 0.406: MP.31 10.8,7.55 10,6.75 9.25,3.25 JP1.P$2
V-
  Top 0.406: U2.2 63.41,13.17 64.08,12.5 R6.1
  Top 1.27: R6.1 64.08,8.5 64.58,8 USBOUT.VBUS

### Text on the board
tDocu: 5s balance board | CUT OUT | - | + | - | - | + | + | - | - | + | + | CUT OUT | + | -
_tsilk: 5V | A6 | A7 | A0 | A1 | D8 | A2 | D7 | A3
HeatSink: D6